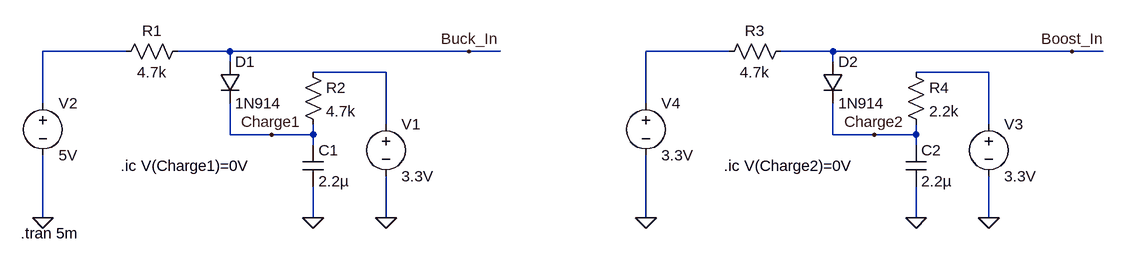
[diagram p0: schematic Gate-Driver-TurnOn.asc]
Gate-Driver-TurnOn.asc, the LTspice schematic file:
Version 4
SHEET 1 1576 680
WIRE 48 96 -80 96
WIRE 208 96 128 96
WIRE 576 96 208 96
WIRE 624 96 576 96
WIRE 976 96 848 96
WIRE 1136 96 1056 96
WIRE 1504 96 1136 96
WIRE 1552 96 1504 96
WIRE 208 112 208 96
WIRE 1136 112 1136 96
WIRE 448 128 336 128
WIRE 1376 128 1264 128
WIRE -80 176 -80 96
WIRE 848 176 848 96
WIRE 448 208 448 128
WIRE 1376 208 1376 128
WIRE 208 224 208 176
WIRE 272 224 208 224
WIRE 336 224 336 208
WIRE 336 224 272 224
WIRE 1136 224 1136 176
WIRE 1200 224 1136 224
WIRE 1264 224 1264 208
WIRE 1264 224 1200 224
WIRE 336 240 336 224
WIRE 1264 240 1264 224
WIRE -80 352 -80 256
WIRE 336 352 336 304
WIRE 448 352 448 288
WIRE 848 352 848 256
WIRE 1264 352 1264 304
WIRE 1376 352 1376 288
FLAG 336 352 0
FLAG 448 352 0
FLAG 272 224 Charge1
FLAG -80 352 0
FLAG 576 96 Buck_In
FLAG 1264 352 0
FLAG 1376 352 0
FLAG 1200 224 Charge2
FLAG 848 352 0
FLAG 1504 96 Boost_In
SYMBOL res 144 80 R90
WINDOW 0 0 56 VBottom 2
WINDOW 3 32 56 VTop 2
SYMATTR InstName R1
SYMATTR Value 4.7k
SYMBOL diode 192 112 R0
SYMATTR InstName D1
SYMATTR Value 1N914
SYMBOL res 320 112 R0
SYMATTR InstName R2
SYMATTR Value 4.7k
SYMBOL cap 320 240 R0
SYMATTR InstName C1
SYMATTR Value 2.2µ
SYMBOL voltage 448 192 R0
WINDOW 123 0 0 Left 0
WINDOW 39 0 0 Left 0
SYMATTR InstName V1
SYMATTR Value 3.3V
SYMBOL voltage -80 160 R0
WINDOW 123 0 0 Left 0
WINDOW 39 0 0 Left 0
SYMATTR InstName V2
SYMATTR Value 5V
SYMBOL res 1072 80 R90
WINDOW 0 0 56 VBottom 2
WINDOW 3 32 56 VTop 2
SYMATTR InstName R3
SYMATTR Value 4.7k
SYMBOL diode 1120 112 R0
SYMATTR InstName D2
SYMATTR Value 1N914
SYMBOL res 1248 112 R0
SYMATTR InstName R4
SYMATTR Value 2.2k
SYMBOL cap 1248 240 R0
SYMATTR InstName C2
SYMATTR Value 2.2µ
SYMBOL voltage 1376 192 R0
WINDOW 123 0 0 Left 0
WINDOW 39 0 0 Left 0
SYMATTR InstName V3
SYMATTR Value 3.3V
SYMBOL voltage 848 160 R0
WINDOW 123 0 0 Left 0
WINDOW 39 0 0 Left 0
SYMATTR InstName V4
SYMATTR Value 3.3V
TEXT 40 272 Left 2 !.ic V(Charge1)=0V
TEXT -114 376 Left 2 !.tran 5m
TEXT 968 272 Left 2 !.ic V(Charge2)=0V

The netlist it stands for:
* Gate-Driver-TurnOn.asc
R1 Buck_In N001 4.7k
D1 Buck_In Charge1 1N914
R2 N003 Charge1 4.7k
C1 Charge1 0 2.2µ
V1 N003 0 3.3V
V2 N001 0 5V
R3 Boost_In N002 4.7k
D2 Boost_In Charge2 1N914
R4 N004 Charge2 2.2k
C2 Charge2 0 2.2µ
V3 N004 0 3.3V
V4 N002 0 3.3V
.model D D
.lib standard.dio
.ic V(Charge1)=0V
.tran 5m
.ic V(Charge2)=0V
.backanno
.end